# Altium schematic sheet Servos.SchDoc
size A4; SheetNumber: 4; SheetTotal: 7
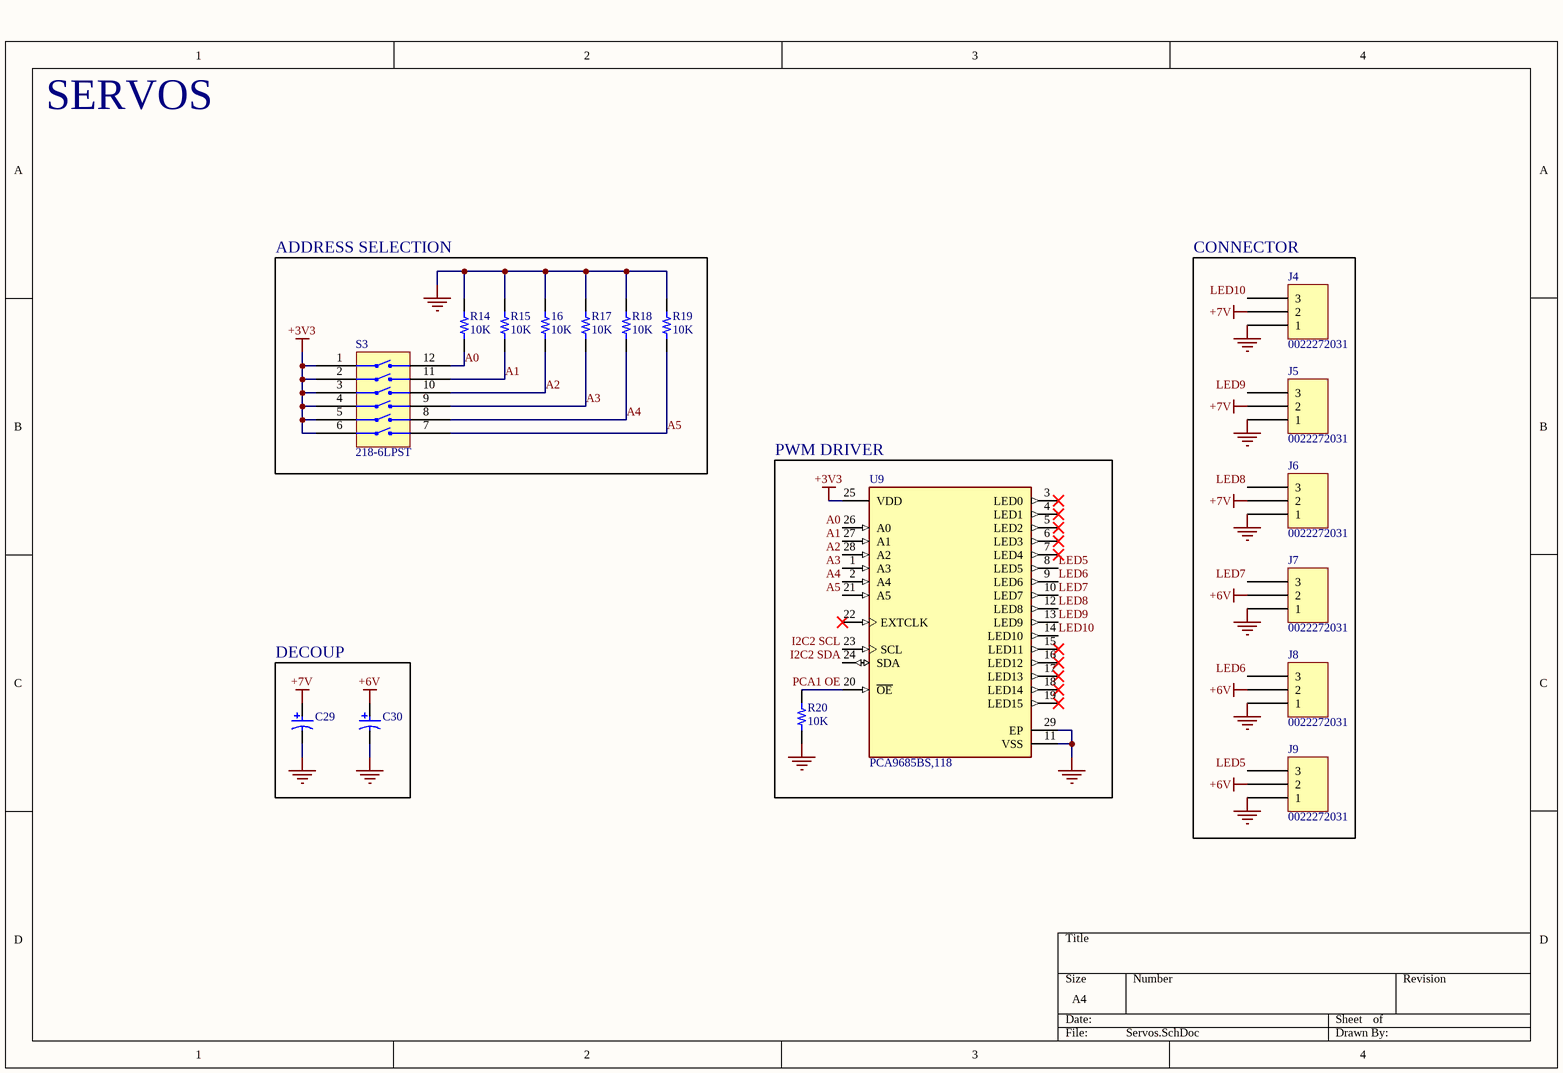
[diagram p0: Servos.SchDoc]

## Parts
16  10K  [RES 0402_1005]
C29  (no value)  [PNSC-FK-V-D8_V]
C30  (no value)  [PNSC-FK-V-D8_V]
J4  0022272031  [MOLEX KK 0022272031]
J5  0022272031  [MOLEX KK 0022272031]
J6  0022272031  [MOLEX KK 0022272031]
J7  0022272031  [MOLEX KK 0022272031]
J8  0022272031  [MOLEX KK 0022272031]
J9  0022272031  [MOLEX KK 0022272031]
R14  10K  [RES 0402_1005]
R15  10K  [RES 0402_1005]
R17  10K  [RES 0402_1005]
R18  10K  [RES 0402_1005]
R19  10K  [RES 0402_1005]
R20  10K  [RES 0402_1005]
S3  218-6LPST  [CTS 218-6LPJ]
U9  PCA9685BS,118  [FP-SOT788-1-IPC_B]

## Blocks framed on the sheet
ADDRESS SELECTION: 16 R14 R15 R17-R19 S3
CONNECTOR: J4-J9
PWM DRIVER: R20 U9
DECOUP: C29 C30

## Nets
+3V3: S3.1(GND) S3.2(GND) S3.3(GND) S3.4(GND) S3.5 S3.6 U9.25(VDD)
+6V: C30.1 J7.2 J8.2 J9.2
+7V: C29.1 J4.2 J5.2 J6.2
GND: 16.2 C29.2 C30.2 J4.1 J5.1 J6.1 J7.1 J8.1 J9.1 R14.2 R15.2 R17.2 R18.2 R19.2 R20.2 U9.11(VSS) U9.29(EP)
A0: R14.1 S3.12 U9.26(A0)
A1: R15.1 S3.11 U9.27(A1)
A2: 16.1 S3.10 U9.28(A2)
A3: R17.1 S3.9 U9.1(A3)
A4: R18.1 S3.8 U9.2(A4)
A5: R19.1 S3.7 U9.21(A5)
I2C2 SCL: U9.23(SCL)
I2C2 SDA: U9.24(SDA)
LED5: J9.3 U9.8(LED5)
LED6: J8.3 U9.9(LED6)
LED7: J7.3 U9.10(LED7)
LED8: J6.3 U9.12(LED8)
LED9: J5.3 U9.13(LED9)
LED10: J4.3 U9.14(LED10)
PCA1 OE: R20.1 U9.20(~{OE})

Not connected (* = marked no-connect by the designer): U9 3(LED0)* 4(LED1)* 5(LED2)* 6(LED3)* 7(LED4)* 15(LED11)* 16(LED12)* 17(LED13)* 18(LED14)* 19(LED15)* 22(EXTCLK)*

## Notes on the sheet
- SERVOS

## Library data of the parts
16 R14 R15 R17-R20 = CPF0402B10KE: RES SMD 10K OHM 0.1% 1/16W 0402; Part Number: CPF0402B10KE
C29 C30 = CMP-2000-06206-1: Aluminum Electrolytic Capacitor, 100 uF, +/- 20%, 25 V, 2-Pin SMD (Size Code D8), -55 to 105 degC, RoHS, Tape and Reel; Manufacturer: Panasonic; Type: Can; Lifetime@Temperature: 2000Hrs@105°C; Capacitance: 100µF; Rated Voltage: 25V; Ripple Current: 280mA; Impedance: 0.34O; Case Size/Dimension: Ø6.3x7.7mm; Operating Temp-Max: 105°C; Series: FK; Package URL: http://industrial.panasonic.com/cdbs/www-data/pdf/RDE0000/DME0000COL48.pdf; Mounting Technology: SurfaceMount; Package Description: 2-Pin Electrolytic Aluminum Capacitor, Body 6.6 x 6.6 mm; Datasheet Version: 03/2016; Datasheet URL: http://industrial.panasonic.com/cdbs/www-data/pdf/RDE0000/ABA0000C1181.pdf; Manufacturer URL: http://www.panasonic.com/; Package Reference: FK-V-D8; Operating Temp Range: -55to+105°C
J4-J9 = 0022272031: CONN HEADER VERT 3POS 2.54MM; Part Number: 0022272031
S3 = 218-6LPST: SWITCH SLIDE DIP SPST 25MA 24V; Part Number: 218-6LPST
U9 = CMP-1595-00001-4: IC LED DRVR LIN DIM 25MA 28HVQFN; Number of Outputs: 16; Output Voltage: 5.5V; Frequency: 50MHz; Min Operating Temperature: -40°C; Package Quantity: 4000; Case/Package: VQFN; Number of Pins: 28; Contact Plating: Gold; Radiation Hardening: No; RoHS Compliant: Yes; Packaging: Tape and Reel; Mount: Surface Mount; Max Operating Temperature: 85°C